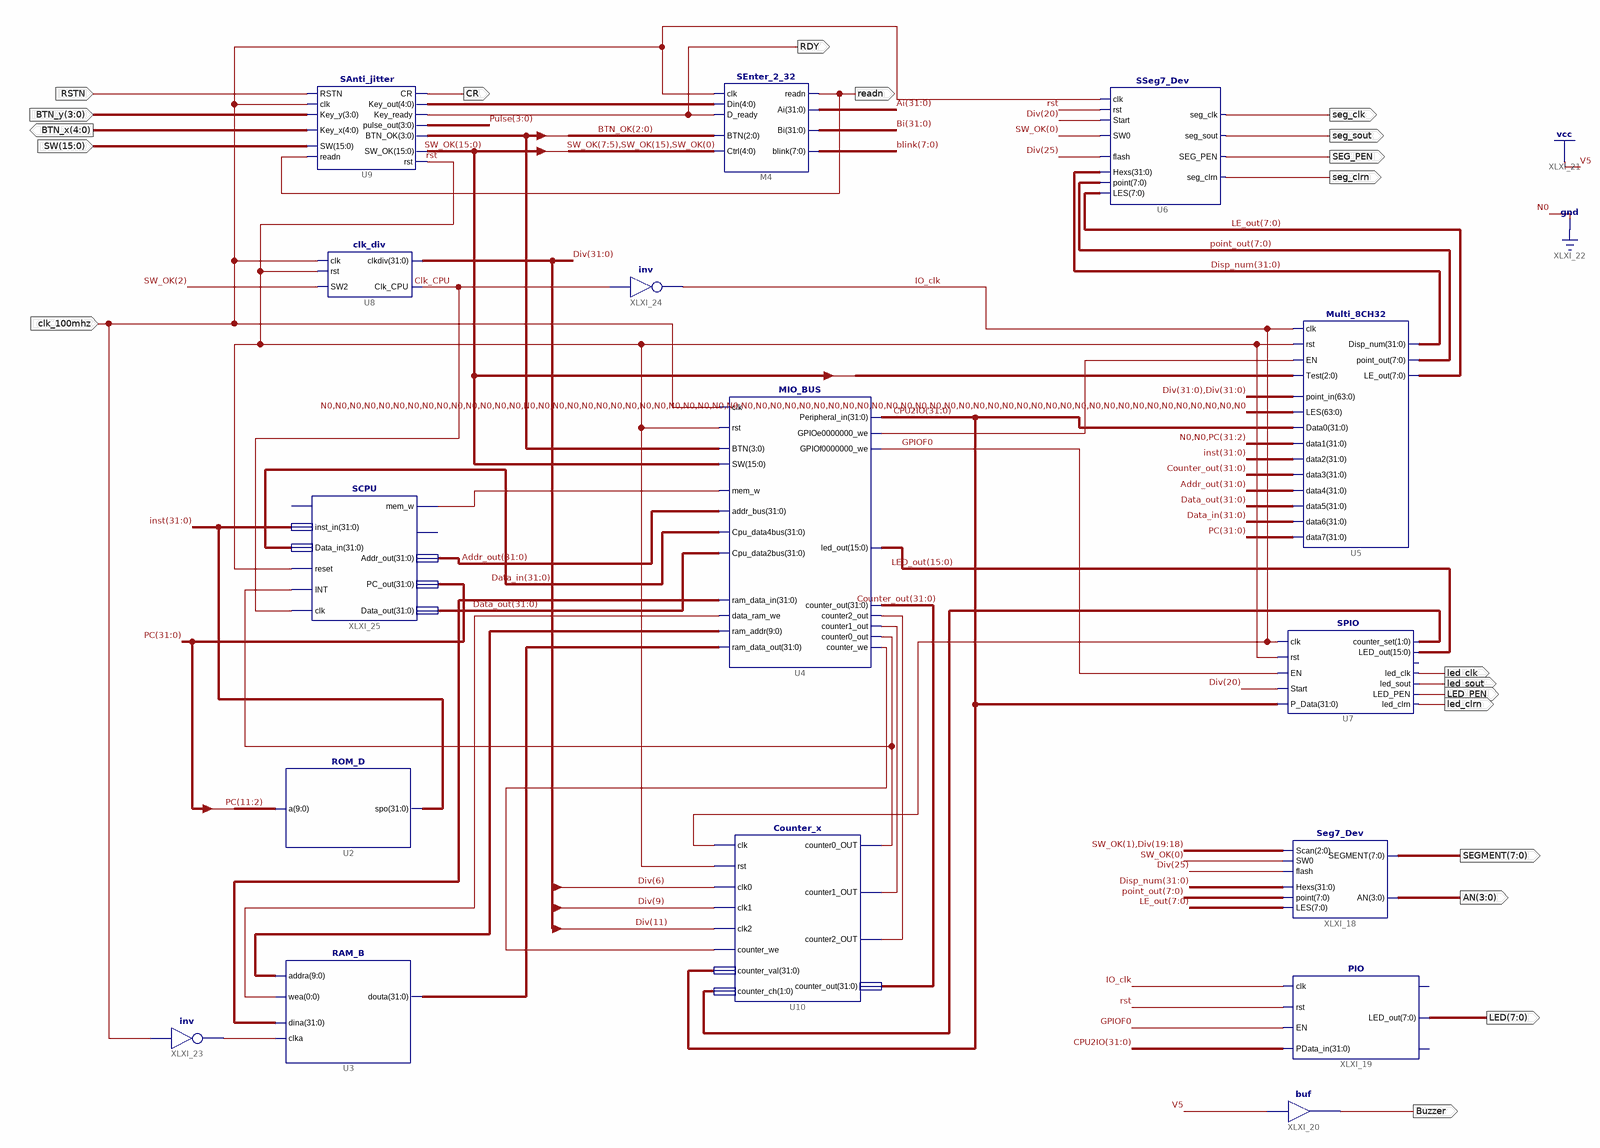
[diagram p0: schematic sheet 1]
// Xilinx ISE schematic Top_Simple_CPU_App.sch (kintex7) as structural Verilog: 16 symbols, 20 ports
module Top_Simple_CPU_App (
  input  RSTN,
  input  [3:0] BTN_y,
  input  [15:0] SW,
  input  clk_100mhz,
  output [7:0] SEGMENT,
  output [3:0] AN,
  output [7:0] LED,
  output Buzzer,
  output seg_clk,
  output seg_sout,
  output SEG_PEN,
  output seg_clrn,
  output [4:0] BTN_x,
  output CR,
  output readn,
  output RDY,
  output led_clk,
  output led_sout,
  output LED_PEN,
  output led_clrn
);

  wire Clk_CPU, GPIOF0, IO_clk, rst, XLXN_56, XLXN_67, XLXN_74, XLXN_79, XLXN_112, XLXN_113, XLXN_116;
  wire [0:0] XLXN_77;
  wire [1:0] XLXN_101;
  wire [3:0] BTN_OK, Pulse;
  wire [4:0] XLXN_36;
  wire [7:0] blink, LE_out, point_out;
  wire [9:0] XLXN_76;
  wire [15:0] LED_out, SW_OK;
  wire [31:0] Addr_out, Ai, Bi, Counter_out, CPU2IO, Data_in, Data_out, Disp_num, Div, inst, PC, XLXN_75,
       XLXN_78;

  ROM_D U2 (.a(PC[11:2]), .spo(inst));
  RAM_B U3 (.addra(XLXN_76), .clka(XLXN_56), .wea(XLXN_77[0]), .dina(XLXN_78), .douta(XLXN_75));
  SPIO U7 (
    .clk(IO_clk), .P_Data(CPU2IO), .rst(rst), .EN(GPIOF0), .Start(Div[20]), .led_clk(led_clk),
    .LED_out(LED_out), .counter_set(XLXN_101), .led_clrn(led_clrn), .LED_PEN(LED_PEN), .led_sout(led_sout));  // open: GPIOf0
  Multi_8CH32 U5 (
    .Test(SW_OK[7:5]), .point_in({Div, Div}), .EN(XLXN_67), .clk(IO_clk), .rst(rst), .LES({64{1'b0}}),
    .Data0(CPU2IO), .data1({2'b00, PC[31:2]}), .data2(inst), .data3(Counter_out), .data4(Addr_out),
    .data5(Data_out), .data6(Data_in), .data7(PC), .point_out(point_out), .LE_out(LE_out), .Disp_num(Disp_num));
  SEnter_2_32 M4 (
    .readn(readn), .Ai(Ai), .Bi(Bi), .blink(blink), .Din(XLXN_36), .D_ready(RDY), .clk(clk_100mhz),
    .Ctrl({SW_OK[7:5], SW_OK[15], SW_OK[0]}), .BTN(BTN_OK[2:0]));
  SSeg7_Dev U6 (
    .LES(LE_out), .SEG_PEN(SEG_PEN), .seg_sout(seg_sout), .seg_clrn(seg_clrn), .point(point_out),
    .Hexs(Disp_num), .SW0(SW_OK[0]), .flash(Div[25]), .seg_clk(seg_clk), .clk(clk_100mhz), .rst(rst),
    .Start(Div[20]));
  SAnti_jitter U9 (
    .SW(SW), .readn(readn), .Key_y(BTN_y), .Key_x(BTN_x), .RSTN(RSTN), .clk(clk_100mhz), .Key_out(XLXN_36),
    .Key_ready(RDY), .CR(CR), .rst(rst), .SW_OK(SW_OK), .pulse_out(Pulse), .BTN_OK(BTN_OK));
  clk_div U8 (.rst(rst), .clk(clk_100mhz), .SW2(SW_OK[2]), .clkdiv(Div), .Clk_CPU(Clk_CPU));
  Counter_x U10 (
    .clk(IO_clk), .rst(rst), .clk0(Div[6]), .clk1(Div[9]), .clk2(Div[11]), .counter_we(XLXN_74),
    .counter_val(CPU2IO), .counter_ch(XLXN_101), .counter0_OUT(XLXN_116), .counter1_OUT(XLXN_112),
    .counter2_OUT(XLXN_113), .counter_out(Counter_out));
  MIO_BUS U4 (
    .rst(rst), .clk(clk_100mhz), .mem_w(XLXN_79), .addr_bus(Addr_out), .Cpu_data4bus(Data_in),
    .Cpu_data2bus(Data_out), .ram_data_out(XLXN_75), .ram_addr(XLXN_76), .data_ram_we(XLXN_77[0]),
    .ram_data_in(XLXN_78), .counter_out(Counter_out), .counter2_out(XLXN_113), .counter1_out(XLXN_112),
    .counter0_out(XLXN_116), .counter_we(XLXN_74), .BTN(BTN_OK), .SW(SW_OK), .led_out(LED_out),
    .Peripheral_in(CPU2IO), .GPIOe0000000_we(XLXN_67), .GPIOf0000000_we(GPIOF0));
  Seg7_Dev XLXI_18 (
    .LES(LE_out), .Scan({SW_OK[1], Div[19:18]}), .SEGMENT(SEGMENT), .AN(AN), .point(point_out),
    .flash(Div[25]), .SW0(SW_OK[0]), .Hexs(Disp_num));
  PIO XLXI_19 (.clk(IO_clk), .rst(rst), .EN(GPIOF0), .PData_in(CPU2IO), .LED_out(LED));  // open: GPIOf0, counter_set
  buf XLXI_20 (Buzzer, 1'b1);
  not XLXI_23 (XLXN_56, clk_100mhz);
  not XLXI_24 (IO_clk, Clk_CPU);
  SCPU XLXI_25 (
    .inst_in(inst), .Data_in(Data_in), .reset(rst), .INT(XLXN_116), .clk(Clk_CPU), .mem_w(XLXN_79),
    .Addr_out(Addr_out), .PC_out(PC), .Data_out(Data_out));  // open: MIO_ready, CPU_MIO
endmodule
